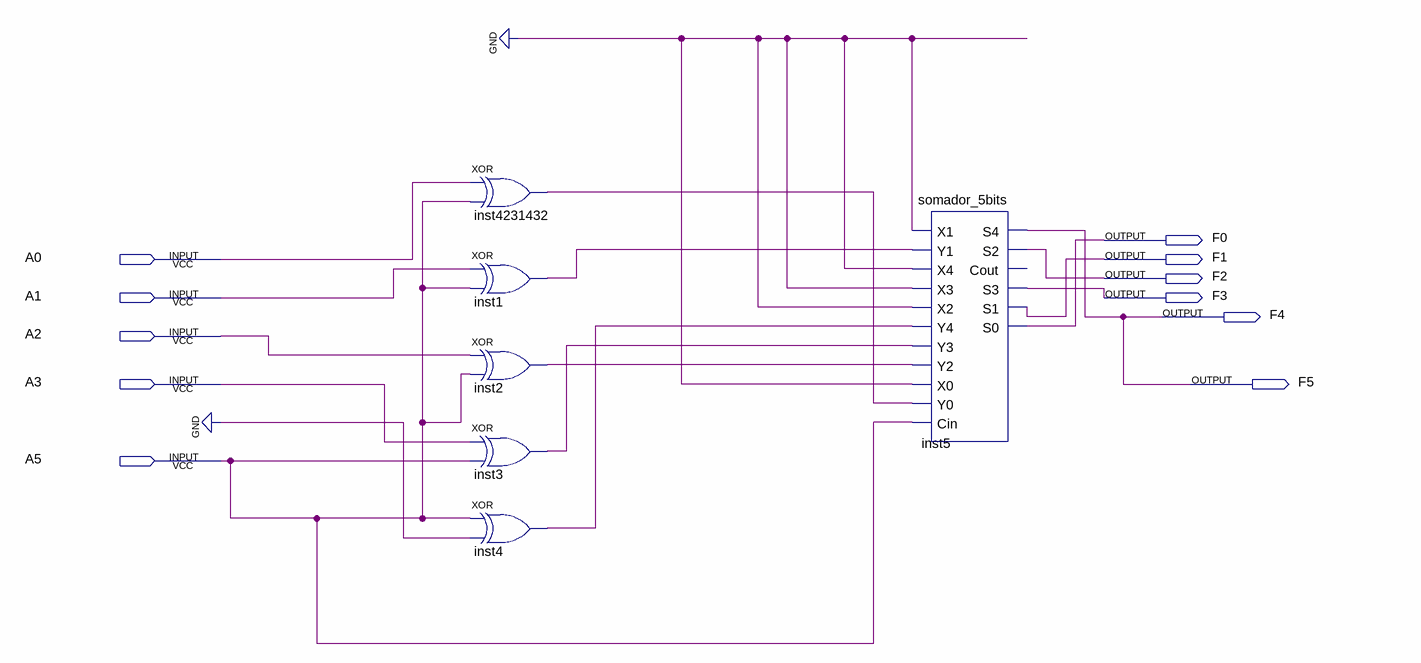
[diagram p0: schematic sheet]
// Quartus schematic conversorexpansor_c2_5pra6bits.bdf as structural Verilog: 6 symbols, 11 pins
module conversorexpansor_c2_5pra6bits (
  input  A0,
  input  A1,
  input  A2,
  input  A3,
  input  A5,
  output F0,
  output F1,
  output F2,
  output F3,
  output F4,
  output F5
);

  wire inst1_out, inst2_out, inst3_out, inst4_out, inst4231432_out;

  xor inst4231432 (inst4231432_out, A0, A5);
  xor inst1 (inst1_out, A1, A5);
  xor inst2 (inst2_out, A2, A5);
  xor inst3 (inst3_out, A3, A5);
  xor inst4 (inst4_out, A5, 1'b0);
  somador_5bits inst5 (
    .X1(1'b0), .Y1(inst1_out), .X4(1'b0), .X3(1'b0), .X2(1'b0), .Y4(inst4_out), .Y3(inst3_out),
    .Y2(inst2_out), .X0(1'b0), .Y0(inst4231432_out), .Cin(A5), .S4(F4), .S2(F2), .S3(F3), .S1(F1), .S0(F0));  // open: Cout

  assign F5 = F4;
endmodule
